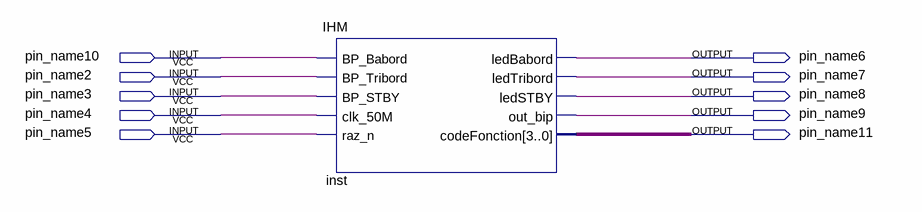
[diagram p0: schematic sheet]
// Quartus schematic IHM.bdf as structural Verilog: 1 symbols, 10 pins
module IHM (
  input  pin_name10,
  input  pin_name2,
  input  pin_name3,
  input  pin_name4,
  input  pin_name5,
  output pin_name6,
  output pin_name7,
  output pin_name8,
  output pin_name9,
  output pin_name11
);

  wire [3:0] inst_codefonction;

  IHM inst (
    .BP_Babord(pin_name10), .BP_Tribord(pin_name2), .BP_STBY(pin_name3), .clk_50M(pin_name4),
    .raz_n(pin_name5), .ledBabord(pin_name6), .ledTribord(pin_name7), .ledSTBY(pin_name8),
    .out_bip(pin_name9), .codeFonction(inst_codefonction));
endmodule
